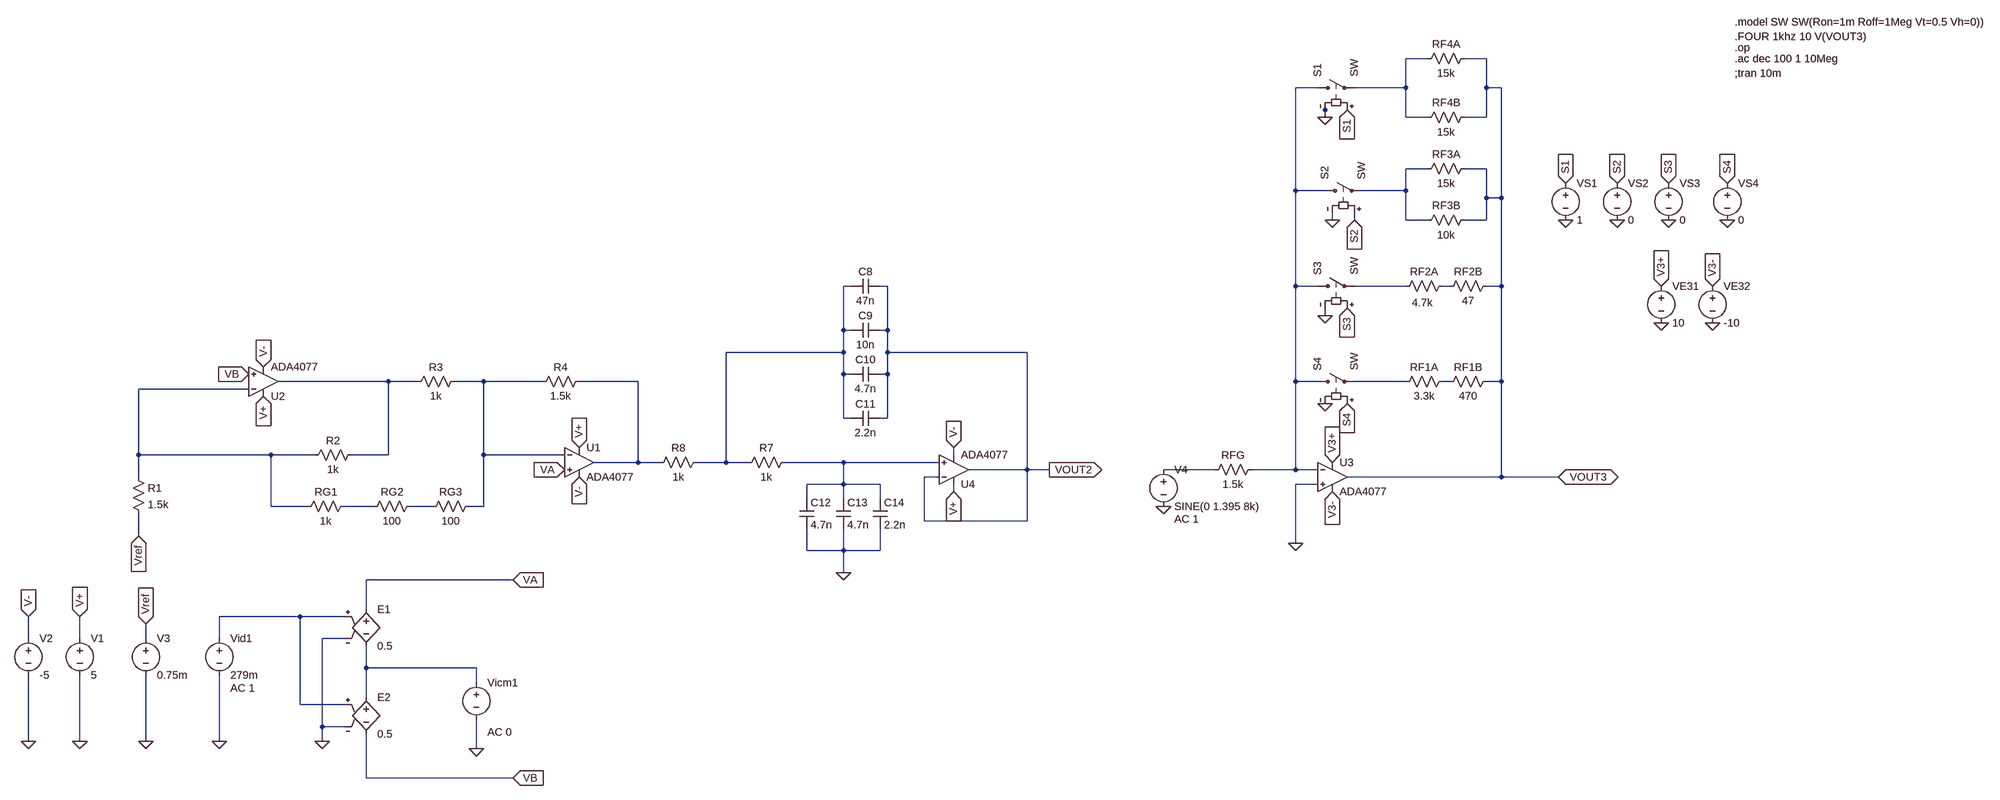
[diagram p0: schematic Etaj 3.asc]
Etaj 3.asc, the LTspice schematic file:
Version 4
SHEET 1 4240 1368
WIRE 2112 -272 2064 -272
WIRE 2240 -272 2192 -272
WIRE 1872 -208 1824 -208
WIRE 2064 -208 2064 -272
WIRE 2064 -208 1952 -208
WIRE 2240 -208 2240 -272
WIRE 2272 -208 2240 -208
WIRE 1888 -160 1888 -176
WIRE 1888 -144 1888 -160
WIRE 2064 -144 2064 -208
WIRE 2112 -144 2064 -144
WIRE 2240 -144 2240 -208
WIRE 2240 -144 2192 -144
WIRE 2112 -32 2064 -32
WIRE 2240 -32 2192 -32
WIRE 1824 16 1824 -208
WIRE 1888 16 1824 16
WIRE 2064 16 2064 -32
WIRE 2064 16 1968 16
WIRE 2240 32 2240 -32
WIRE 2272 32 2272 -208
WIRE 2272 32 2240 32
WIRE 1904 80 1904 64
WIRE 1952 80 1952 64
WIRE 2064 80 2064 16
WIRE 2112 80 2064 80
WIRE 2240 80 2240 32
WIRE 2240 80 2192 80
WIRE 560 224 544 224
WIRE 640 224 624 224
WIRE 1824 224 1824 16
WIRE 1872 224 1824 224
WIRE 2064 224 1952 224
WIRE 2160 224 2144 224
WIRE 2272 224 2272 32
WIRE 2272 224 2240 224
WIRE 1888 288 1888 272
WIRE 544 320 544 224
WIRE 560 320 544 320
WIRE 640 320 640 224
WIRE 640 320 624 320
WIRE 544 368 544 320
WIRE 544 368 288 368
WIRE 640 368 640 320
WIRE 944 368 640 368
WIRE 544 416 544 368
WIRE 560 416 544 416
WIRE 640 416 640 368
WIRE 640 416 624 416
WIRE -448 432 -688 432
WIRE -384 432 -448 432
WIRE -240 432 -304 432
WIRE -112 432 -240 432
WIRE 96 432 -32 432
WIRE 1824 432 1824 224
WIRE 1872 432 1824 432
WIRE 2064 432 1952 432
WIRE 2160 432 2144 432
WIRE 2272 432 2272 224
WIRE 2272 432 2240 432
WIRE -752 448 -992 448
WIRE 544 512 544 416
WIRE 560 512 544 512
WIRE 640 512 640 416
WIRE 640 512 624 512
WIRE -992 592 -992 448
WIRE -704 592 -992 592
WIRE -608 592 -704 592
WIRE -448 592 -448 432
WIRE -448 592 -528 592
WIRE -240 592 -240 432
WIRE -64 592 -240 592
WIRE 784 592 784 576
WIRE 96 608 96 432
WIRE 96 608 0 608
WIRE 144 608 96 608
WIRE 288 608 288 368
WIRE 288 608 224 608
WIRE 336 608 288 608
WIRE 544 608 416 608
WIRE 752 608 544 608
WIRE 944 624 944 368
WIRE 944 624 816 624
WIRE 992 624 944 624
WIRE 1648 624 1536 624
WIRE 1824 624 1824 432
WIRE 1824 624 1728 624
WIRE 1872 624 1824 624
WIRE -992 640 -992 592
WIRE 752 640 720 640
WIRE 2272 640 2272 432
WIRE 2272 640 1936 640
WIRE 2448 640 2272 640
WIRE 544 656 544 608
WIRE 544 656 464 656
WIRE 624 656 544 656
WIRE 1872 656 1824 656
WIRE 784 672 784 656
WIRE 464 688 464 656
WIRE 544 688 544 656
WIRE 624 688 624 656
WIRE -704 704 -704 592
WIRE -624 704 -704 704
WIRE -480 704 -544 704
WIRE -352 704 -400 704
WIRE -240 704 -240 592
WIRE -240 704 -272 704
WIRE 720 736 720 640
WIRE 944 736 944 624
WIRE 944 736 720 736
WIRE -992 768 -992 720
WIRE 1824 784 1824 656
WIRE 464 800 464 752
WIRE 544 800 544 752
WIRE 544 800 464 800
WIRE 624 800 624 752
WIRE 624 800 544 800
WIRE 544 848 544 800
WIRE -176 864 -496 864
WIRE -496 928 -496 864
WIRE -640 944 -816 944
WIRE -544 944 -640 944
WIRE -1232 992 -1232 944
WIRE -1120 992 -1120 944
WIRE -976 992 -976 960
WIRE -816 992 -816 944
WIRE -544 992 -592 992
WIRE -496 1056 -496 1008
WIRE -256 1056 -496 1056
WIRE -256 1088 -256 1056
WIRE -496 1120 -496 1056
WIRE -640 1136 -640 944
WIRE -544 1136 -640 1136
WIRE -592 1184 -592 992
WIRE -544 1184 -592 1184
WIRE -1232 1216 -1232 1072
WIRE -1120 1216 -1120 1072
WIRE -976 1216 -976 1072
WIRE -816 1216 -816 1072
WIRE -592 1216 -592 1184
WIRE -256 1232 -256 1168
WIRE -496 1296 -496 1200
WIRE -176 1296 -496 1296
FLAG -1120 1216 0
FLAG -1232 1216 0
FLAG -1120 944 V+
IOPIN -1120 944 In
FLAG -1232 944 V-
IOPIN -1232 944 In
FLAG -32 640 V-
IOPIN -32 640 In
FLAG -720 400 V-
IOPIN -720 400 In
FLAG -32 576 V+
IOPIN -32 576 In
FLAG -720 464 V+
IOPIN -720 464 In
FLAG -64 624 VA
IOPIN -64 624 In
FLAG -752 416 VB
IOPIN -752 416 In
FLAG -816 1216 0
FLAG -592 1216 0
FLAG -256 1232 0
FLAG -176 864 VA
IOPIN -176 864 In
FLAG -176 1296 VB
IOPIN -176 1296 In
FLAG -976 960 Vref
IOPIN -976 960 In
FLAG -992 768 Vref
IOPIN -992 768 In
FLAG -976 1216 0
FLAG 992 624 VOUT2
IOPIN 992 624 Out
FLAG 784 672 V+
IOPIN 784 672 In
FLAG 784 576 V-
IOPIN 784 576 In
FLAG 544 848 0
FLAG 1824 784 0
FLAG 2448 640 VOUT3
IOPIN 2448 640 BiDir
FLAG 1904 608 V3+
IOPIN 1904 608 In
FLAG 1904 672 V3-
IOPIN 1904 672 In
FLAG 1888 -144 0
FLAG 1904 80 0
FLAG 1888 288 0
FLAG 1888 480 0
FLAG 1936 -160 S1
IOPIN 1936 -160 In
FLAG 1952 80 S2
IOPIN 1952 80 In
FLAG 1936 272 S3
IOPIN 1936 272 In
FLAG 1936 480 S4
IOPIN 1936 480 In
FLAG 2464 80 0
FLAG 2576 80 0
FLAG 2688 80 0
FLAG 2816 80 0
FLAG 2464 0 S1
IOPIN 2464 0 In
FLAG 2576 0 S2
IOPIN 2576 0 In
FLAG 2688 0 S3
IOPIN 2688 0 In
FLAG 2816 0 S4
IOPIN 2816 0 In
FLAG 2672 304 0
FLAG 2784 304 0
FLAG 2672 224 V3+
IOPIN 2672 224 In
FLAG 2784 224 V3-
IOPIN 2784 224 In
FLAG 1536 704 0
DATAFLAG 944 624 ""
DATAFLAG 1600 624 ""
DATAFLAG 2272 640 ""
SYMBOL res -1008 624 R0
SYMATTR InstName R1
SYMATTR Value 1.5k
SYMBOL res -512 576 R90
WINDOW 0 0 56 VBottom 2
WINDOW 3 32 56 VTop 2
SYMATTR InstName R2
SYMATTR Value 1k
SYMBOL res -288 416 R90
WINDOW 0 0 56 VBottom 2
WINDOW 3 32 56 VTop 2
SYMATTR InstName R3
SYMATTR Value 1k
SYMBOL res -16 416 R90
WINDOW 0 0 56 VBottom 2
WINDOW 3 32 56 VTop 2
SYMATTR InstName R4
SYMATTR Value 1.5k
SYMBOL res -528 688 R90
WINDOW 0 0 56 VBottom 2
WINDOW 3 32 56 VTop 2
SYMATTR InstName RG1
SYMATTR Value 1k
SYMBOL voltage -1120 976 R0
WINDOW 123 24 44 Left 2
WINDOW 39 0 0 Left 0
SYMATTR InstName V1
SYMATTR Value 5
SYMBOL voltage -1232 976 R0
WINDOW 123 24 44 Left 2
WINDOW 39 0 0 Left 0
SYMATTR InstName V2
SYMATTR Value -5
SYMBOL e -496 912 R0
SYMATTR InstName E1
SYMATTR Value 0.5
SYMBOL e -496 1104 R0
SYMATTR InstName E2
SYMATTR Value 0.5
SYMBOL voltage -256 1072 R0
WINDOW 123 24 124 Left 2
WINDOW 39 0 0 Left 0
SYMATTR Value2 AC 0
SYMATTR InstName Vicm1
SYMATTR Value ""
SYMBOL voltage -816 976 R0
WINDOW 123 24 124 Left 2
WINDOW 39 0 0 Left 0
SYMATTR Value2 AC 1
SYMATTR InstName Vid1
SYMATTR Value 279m
SYMBOL voltage -976 976 R0
WINDOW 123 0 0 Left 0
WINDOW 39 0 0 Left 0
SYMATTR InstName V3
SYMATTR Value 0.75m
SYMBOL res -384 688 R90
WINDOW 0 0 56 VBottom 2
WINDOW 3 32 56 VTop 2
SYMATTR InstName RG2
SYMATTR Value 100
SYMBOL res -256 688 R90
WINDOW 0 0 56 VBottom 2
WINDOW 3 32 56 VTop 2
SYMATTR InstName RG3
SYMATTR Value 100
SYMBOL OpAmps\\ADA4077 -32 544 R0
SYMATTR InstName U1
SYMBOL OpAmps\\ADA4077 -720 496 M180
SYMATTR InstName U2
SYMBOL OpAmps\\ADA4077 784 688 M180
SYMATTR InstName U4
SYMBOL res 432 592 R90
WINDOW 0 0 56 VBottom 2
WINDOW 3 32 56 VTop 2
SYMATTR InstName R7
SYMATTR Value 1k
SYMBOL res 240 592 R90
WINDOW 0 0 56 VBottom 2
WINDOW 3 32 56 VTop 2
SYMATTR InstName R8
SYMATTR Value 1k
SYMBOL cap 624 208 R90
WINDOW 0 0 32 VBottom 2
WINDOW 3 32 32 VTop 2
SYMATTR InstName C8
SYMATTR Value 47n
SYMBOL cap 624 304 R90
WINDOW 0 0 32 VBottom 2
WINDOW 3 32 32 VTop 2
SYMATTR InstName C9
SYMATTR Value 10n
SYMBOL cap 624 400 R90
WINDOW 0 0 32 VBottom 2
WINDOW 3 32 32 VTop 2
SYMATTR InstName C10
SYMATTR Value 4.7n
SYMBOL cap 624 496 R90
WINDOW 0 0 32 VBottom 2
WINDOW 3 32 32 VTop 2
SYMATTR InstName C11
SYMATTR Value 2.2n
SYMBOL cap 448 688 R0
SYMATTR InstName C12
SYMATTR Value 4.7n
SYMBOL cap 528 688 R0
SYMATTR InstName C13
SYMATTR Value 4.7n
SYMBOL cap 608 688 R0
SYMATTR InstName C14
SYMATTR Value 2.2n
SYMBOL OpAmps\\ADA4077 1904 576 R0
SYMATTR InstName U3
SYMBOL sw 1856 -208 R270
SYMATTR InstName S1
SYMBOL sw 1872 16 R270
SYMATTR InstName S2
SYMBOL sw 1856 224 R270
SYMATTR InstName S3
SYMBOL sw 1856 432 R270
SYMATTR InstName S4
SYMBOL res 1744 608 R90
WINDOW 0 0 56 VBottom 2
WINDOW 3 32 56 VTop 2
SYMATTR InstName RFG
SYMATTR Value 1.5k
SYMBOL res 2208 -48 R90
WINDOW 0 0 56 VBottom 2
WINDOW 3 32 56 VTop 2
SYMATTR InstName RF3A
SYMATTR Value 15k
SYMBOL res 2160 208 R90
WINDOW 0 0 56 VBottom 2
WINDOW 3 36 60 VTop 2
SYMATTR InstName RF2A
SYMATTR Value 4.7k
SYMBOL res 2160 416 R90
WINDOW 0 0 56 VBottom 2
WINDOW 3 32 56 VTop 2
SYMATTR InstName RF1A
SYMATTR Value 3.3k
SYMBOL res 2256 416 R90
WINDOW 0 0 56 VBottom 2
WINDOW 3 32 56 VTop 2
SYMATTR InstName RF1B
SYMATTR Value 470
SYMBOL res 2256 208 R90
WINDOW 0 0 56 VBottom 2
WINDOW 3 32 56 VTop 2
SYMATTR InstName RF2B
SYMATTR Value 47
SYMBOL res 2208 64 R90
WINDOW 0 0 56 VBottom 2
WINDOW 3 33 56 VTop 2
SYMATTR InstName RF3B
SYMATTR Value 10k
SYMBOL res 2208 -288 R90
WINDOW 0 0 56 VBottom 2
WINDOW 3 32 56 VTop 2
SYMATTR InstName RF4A
SYMATTR Value 15k
SYMBOL res 2208 -160 R90
WINDOW 0 0 56 VBottom 2
WINDOW 3 33 56 VTop 2
SYMATTR InstName RF4B
SYMATTR Value 15k
SYMBOL voltage 2464 -16 R0
WINDOW 123 0 0 Left 0
WINDOW 39 0 0 Left 0
SYMATTR InstName VS1
SYMATTR Value 1
SYMBOL voltage 2576 -16 R0
WINDOW 123 0 0 Left 0
WINDOW 39 0 0 Left 0
SYMATTR InstName VS2
SYMATTR Value 0
SYMBOL voltage 2688 -16 R0
WINDOW 123 0 0 Left 0
WINDOW 39 0 0 Left 0
SYMATTR InstName VS3
SYMATTR Value 0
SYMBOL voltage 2816 -16 R0
WINDOW 123 0 0 Left 0
WINDOW 39 0 0 Left 0
SYMATTR InstName VS4
SYMATTR Value 0
SYMBOL voltage 2672 208 R0
SYMATTR InstName VE31
SYMATTR Value 10
SYMBOL voltage 2784 208 R0
SYMATTR InstName VE32
SYMATTR Value -10
SYMBOL voltage 1536 608 R0
WINDOW 123 24 124 Left 2
WINDOW 39 0 0 Left 0
SYMATTR Value2 AC 1
SYMATTR InstName V4
SYMATTR Value SINE(0 1.395 8k)
TEXT 2832 -272 Left 2 !.ac dec 100 1 10Meg
TEXT 2832 -296 Left 2 !.op
TEXT 2832 -240 Left 2 !;tran 10m
TEXT 2832 -320 Left 2 !.FOUR 1khz 10 V(VOUT3)
TEXT 2832 -352 Left 2 !.model SW SW(Ron=1m Roff=1Meg Vt=0.5 Vh=0))

The netlist it stands for:
* Etaj 3.asc
R1 N012 Vref 1.5k
R2 N007 N012 1k
R3 N008 N007 1k
R4 N009 N008 1.5k
RG1 N015 N012 1k
V1 V+ 0 5
V2 V- 0 -5
E1 VA N018 N017 0 0.5
E2 N018 VB N017 0 0.5
Vicm1 N018 0 AC 0
Vid1 N017 0 279m AC 1
V3 Vref 0 0.75m
RG2 N016 N015 100
RG3 N008 N016 100
XU1 VA N008 V+ V- N009 ADA4077  ; pins In+ In- V+ V- OUT
XU2 VB N012 V+ V- N007 ADA4077  ; pins In+ In- V+ V- OUT
XU4 N013 VOUT2 V+ V- VOUT2 ADA4077  ; pins In+ In- V+ V- OUT
R7 N013 N004 1k
R8 N004 N009 1k
C8 VOUT2 N004 47n
C9 VOUT2 N004 10n
C10 VOUT2 N004 4.7n
C11 VOUT2 N004 2.2n
C12 N013 0 4.7n
C13 N013 0 4.7n
C14 N013 0 2.2n
XU3 0 N002 V3+ V3- VOUT3 ADA4077  ; pins In+ In- V+ V- OUT
S1 N002 N001 S1 0 SW
S2 N002 N003 S2 0 SW
S3 N002 N005 S3 0 SW
S4 N002 N010 S4 0 SW
RFG N002 N014 1.5k
RF3A VOUT3 N003 15k
RF2A N006 N005 4.7k
RF1A N011 N010 3.3k
RF1B VOUT3 N011 470
RF2B VOUT3 N006 47
RF3B VOUT3 N003 10k
RF4A VOUT3 N001 15k
RF4B VOUT3 N001 15k
VS1 S1 0 1
VS2 S2 0 0
VS3 S3 0 0
VS4 S4 0 0
VE31 V3+ 0 10
VE32 V3- 0 -10
V4 N014 0 SINE(0 1.395 8k) AC 1
.ac dec 100 1 10Meg
.op
;tran 10m
.FOUR 1khz 10 V(VOUT3)
.model SW SW(Ron=1m Roff=1Meg Vt=0.5 Vh=0))
.backanno
.end